# EAGLE design H0FR1 (EAGLE 9.6.1)

## Sheet 1 of 2
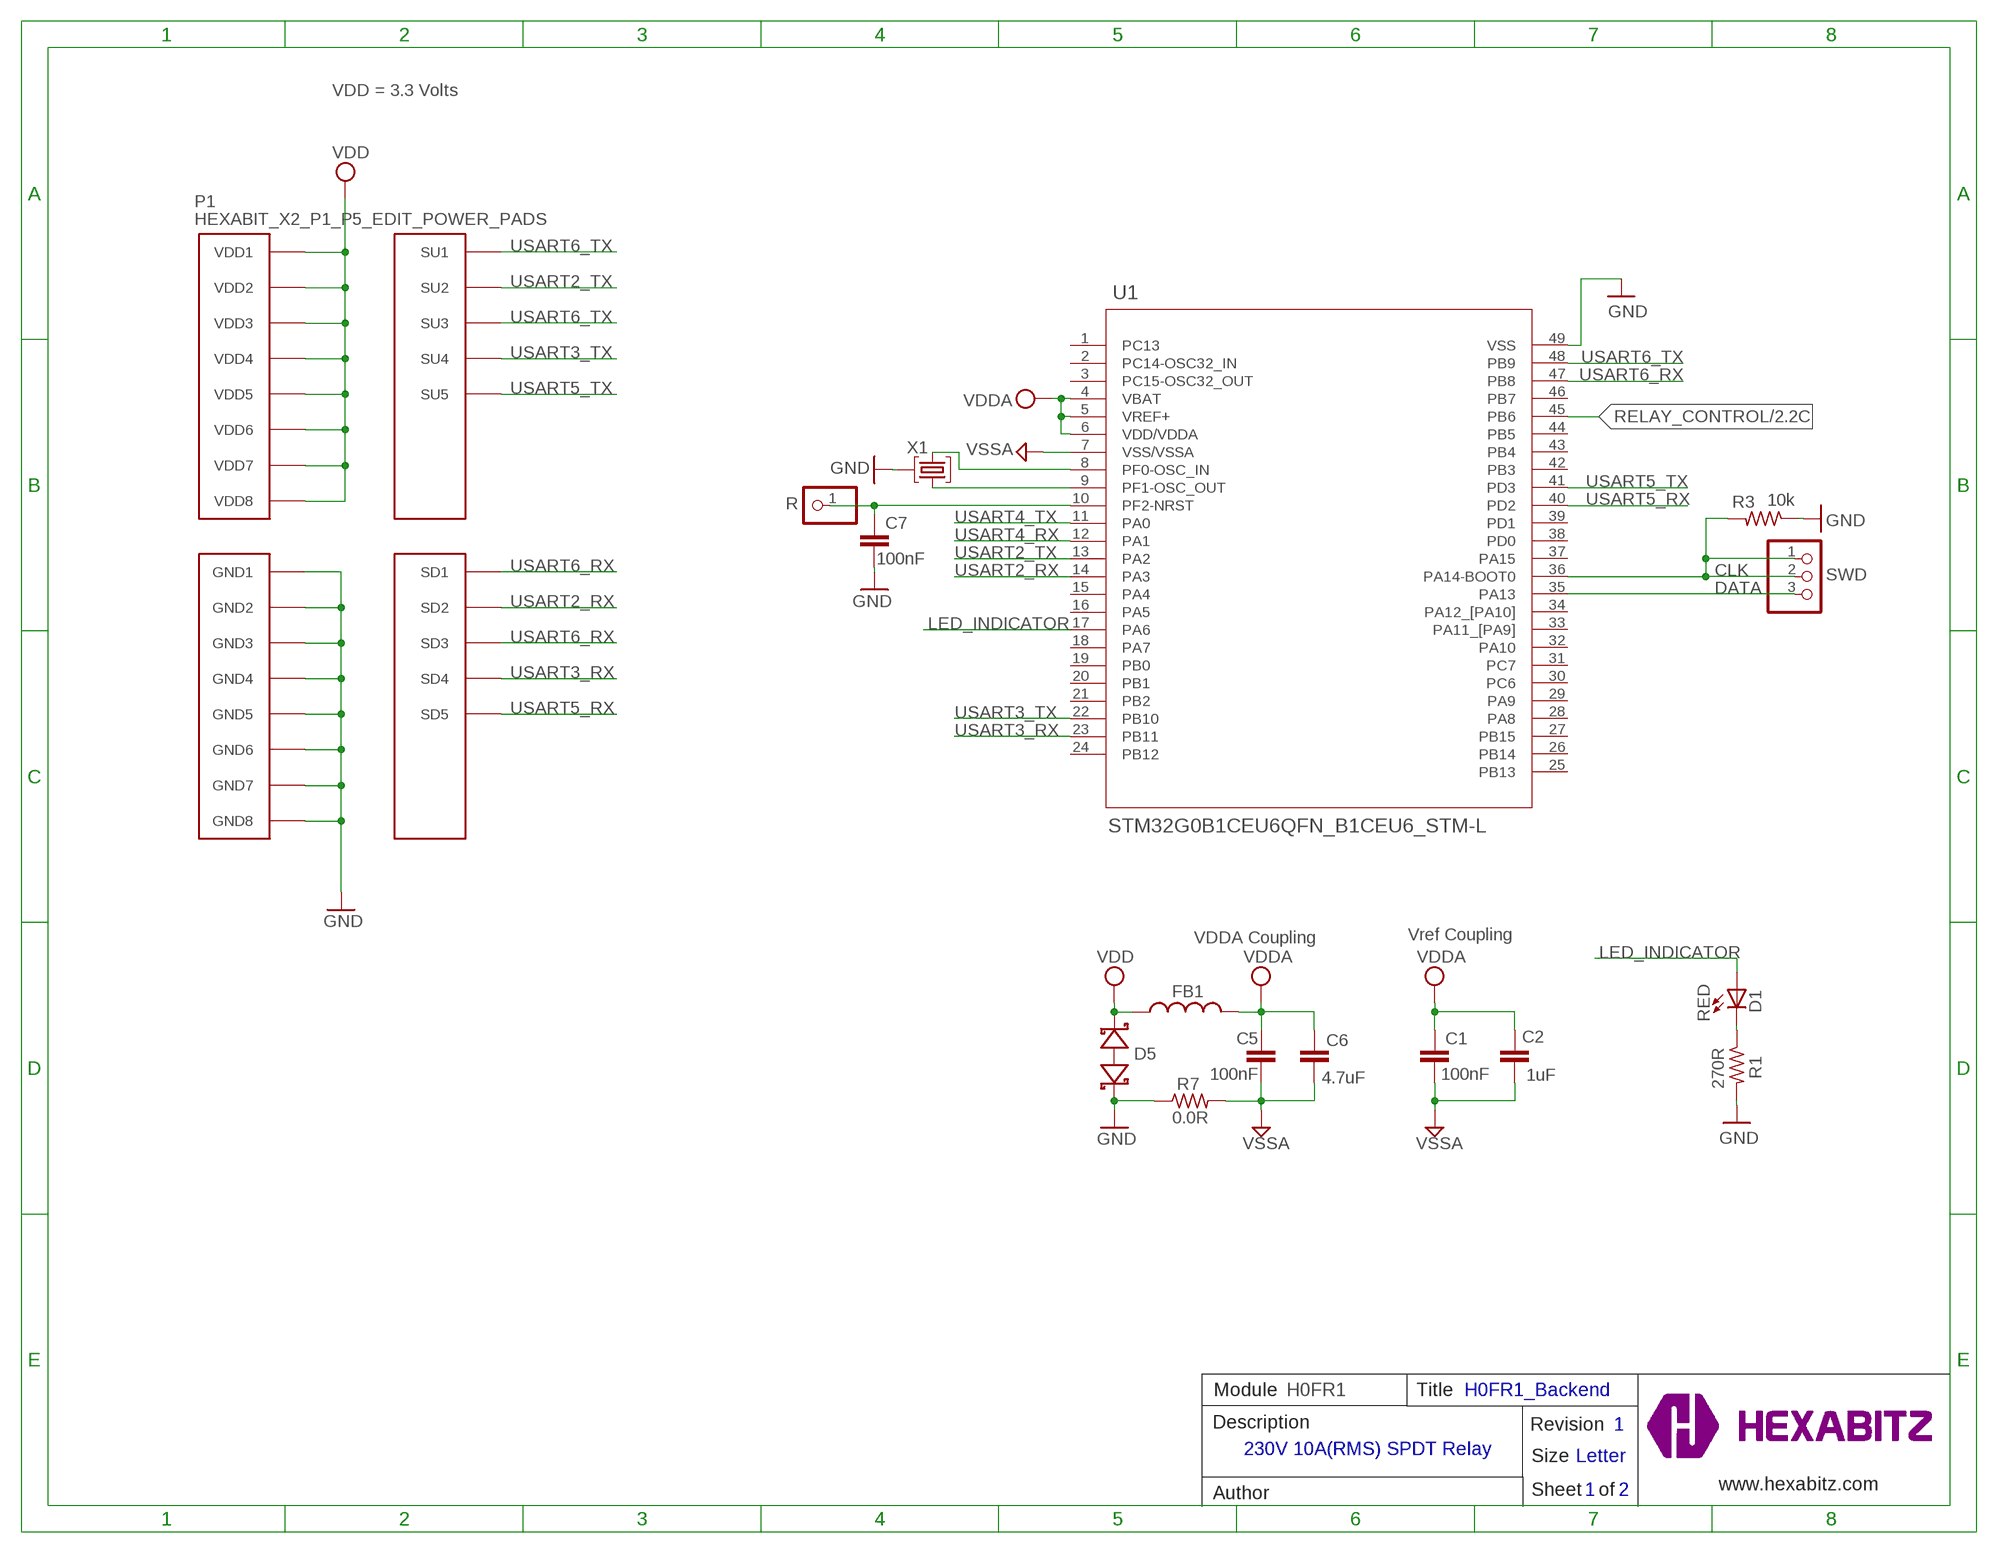
[diagram p0: schematic, sheet 1]

### Parts
C1  100nF  C-0603  [C-0603]
C2  1uF  C-0805  [C-0805]
C5  100nF  C-0603  [C-0603]
C6  4.7uF  C-0805  [C-0805]
C7  100nF  C-0603  [C-0603]
D1  RED  VLMS1300-GS08  [VLMS1300-GS08]
D5  BOURNS_CDSOD323-T03SCBOURNS_CDSOD323-T03SC_0_0  [BOURNS_CDSOD323-T03SC_0]
FB1  FB-0603  [FB-0603]
P1  HEXABIT_X2_P1_P5_EDIT_POWER_PADS  [HEXABIT_X2_P1_P5_EDIT_POWER_PADS]
R  R  PINHD-1X1  [1X01]
R1  270R  R-0603  [R-0603]
R3  10k  R-0603  [R-0603]
R7  0.0R  R-0603  [R-0603]
SWD  PINHD-1X3SWD  [SWD]
TRIMBLE-LOGO2  HEXA-LOGO  [HEXA-LOGO]
U1  STM32G0B1CEU6QFN_B1CEU6_STM-L  [QFN_B1CEU6_STM-L]
X1  XTALL_CSTCE8M00G52  [XTALL_CSTCE8M00G52]

### Nets
CLK: R3.2 SWD.1 SWD.2 U1.36(PA14-BOOT0)
DATA: SWD.3 U1.35(PA13)
GND: C7.2 D5.2(C) P1.PAD_PD11(GND1) P1.PAD_PD12(GND2) P1.PAD_PD13(GND3) P1.PAD_PD14(GND4) P1.PAD_PD17(GND5) P1.PAD_PD18(GND6) P1.PAD_PD19(GND7) P1.PAD_PD20(GND8) R1.2 R3.1 R7.1 U1.49(VSS) X1.P$2 ; also sheet 2
LED_INDICATOR: D1.A U1.17(PA6)
N$2: D1.C R1.1
N$4: C7.1 R.1 U1.10(PF2-NRST)
N$5: U1.9(PF1-OSC_OUT) X1.P$1
N$6: U1.8(PF0-OSC_IN) X1.P$3
RELAY_CONTROL: U1.45(PB6) ; also sheet 2
USART2_RX: P1.PAD_PD2(SD2) U1.14(PA3)
USART2_TX: P1.PAD_PU2(SU2) U1.13(PA2)
USART3_RX: P1.PAD_PD4(SD4) U1.23(PB11)
USART3_TX: P1.PAD_PU4(SU4) U1.22(PB10)
USART4_RX: U1.12(PA1)
USART4_TX: U1.11(PA0)
USART5_RX: P1.PAD_PD5(SD5) U1.40(PD2)
USART5_TX: P1.PAD_PU5(SU5) U1.41(PD3)
USART6_RX: P1.PAD_PD1(SD1) P1.PAD_PD3(SD3) U1.47(PB8)
USART6_TX: P1.PAD_PU1(SU1) P1.PAD_PU3(SU3) U1.48(PB9)
VDD: D5.1(A) FB1.1 P1.PAD_PU11(VDD1) P1.PAD_PU12(VDD2) P1.PAD_PU13(VDD3) P1.PAD_PU14(VDD4) P1.PAD_PU17(VDD5) P1.PAD_PU18(VDD6) P1.PAD_PU19(VDD7) P1.PAD_PU20(VDD8) ; also sheet 2
VDDA: C1.1 C2.1 C5.1 C6.1 FB1.2 U1.4(VBAT) U1.5(VREF+) U1.6(VDD/VDDA)
VSSA: C1.2 C2.2 C5.2 C6.2 R7.2 U1.7(VSS/VSSA)
Unconnected: U1.1(PC13) U1.2(PC14-OSC32_IN) U1.3(PC15-OSC32_OUT) U1.15(PA4) U1.16(PA5) U1.18(PA7) U1.19(PB0) U1.20(PB1) U1.21(PB2) U1.24(PB12) U1.25(PB13) U1.26(PB14) U1.27(PB15) U1.28(PA8) U1.29(PA9) U1.30(PC6) U1.31(PC7) U1.32(PA10) U1.33(PA11_[PA9]) U1.34(PA12_[PA10]) U1.37(PA15) U1.38(PD0) U1.39(PD1) U1.42(PB3) U1.43(PB4) U1.44(PB5) U1.46(PB7)

### Notes on the sheet
- VDD = 3.3 Volts
- BOOT
- VDDA Coupling | Vref Coupling
- Module | H0FR1 | Title | H0FR1_Backend
- Description | Revision | 1
- 230V 10A(RMS) SPDT Relay
- Size | Letter
- www.hexabitz.com
- Author | Sheet   of | 1 | 2
- C:/Users/Admin/Desktop/logodraft.bmp

## Sheet 2 of 2
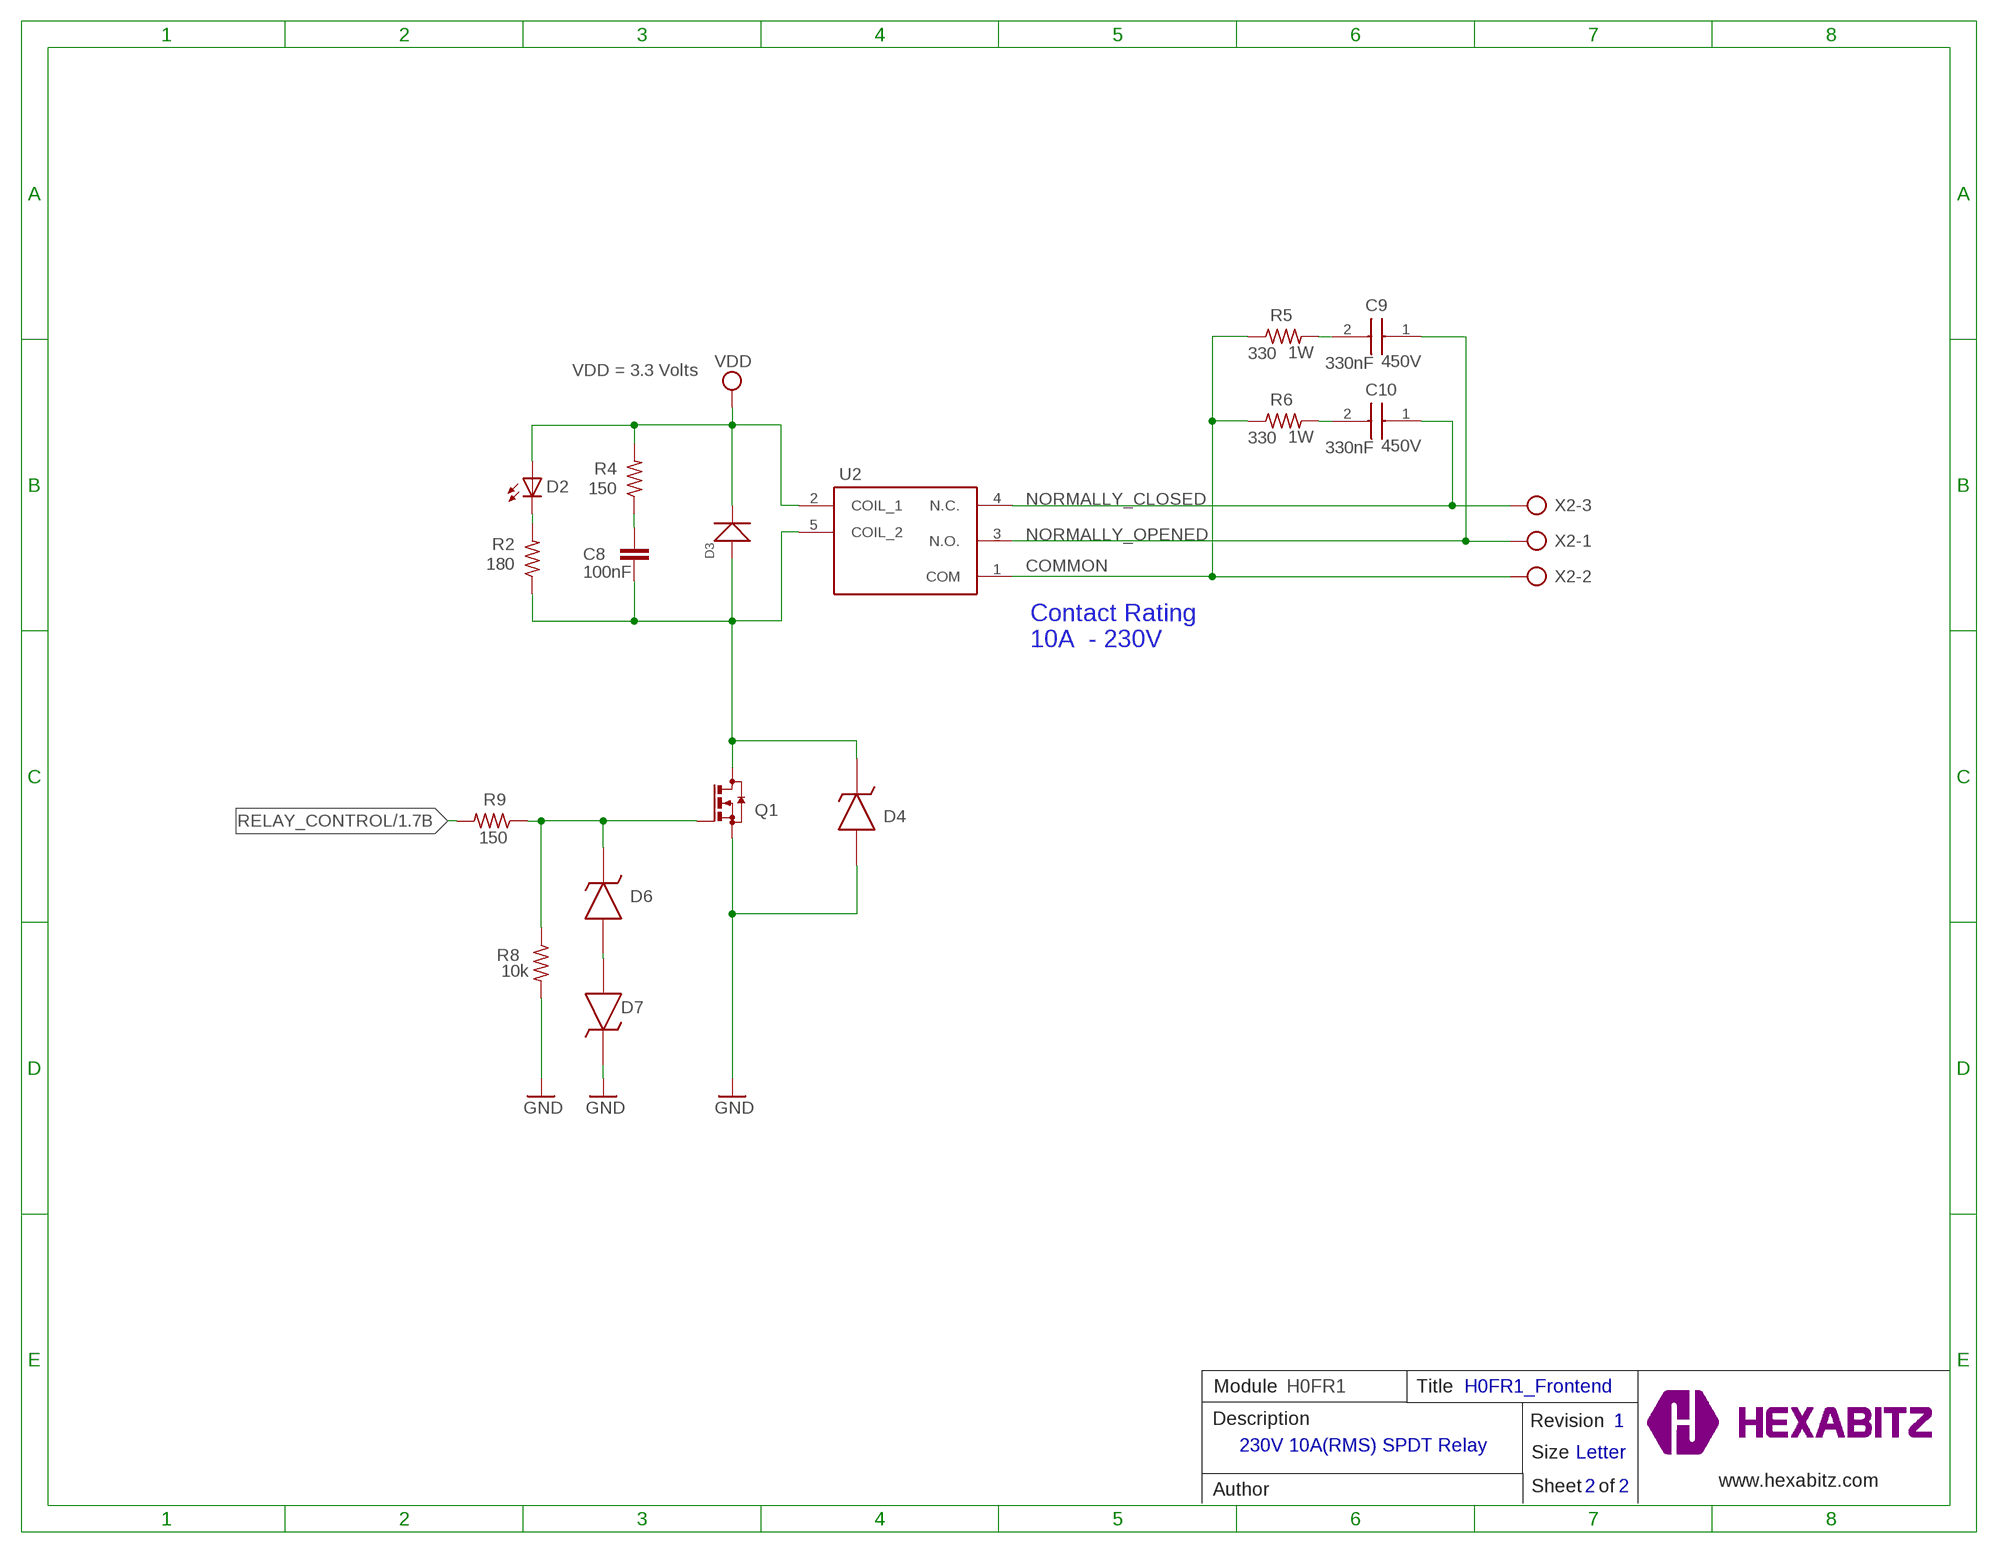
[diagram p1: schematic, sheet 2]

### Parts
C8  100nF  C-0603  [C-0603]
C9  330nF  B32922Q3334K000  [B32922Q_(18_X_8.5)]
C10  330nF  B32922Q3334K000  [B32922Q_(18_X_8.5)]
D2  RED  VLMS1300-GS08  [VLMS1300-GS08]
D3  40V 300MA  BAT54JFILM_SOD-323  [SOD-323]
D4  MMSZ4705T1GMMSZ4705T1G  [DIO_MMSZ4700T1G]
D6  MMSZ4705T1GMMSZ4705T1G  [DIO_MMSZ4700T1G]
D7  MMSZ4705T1GMMSZ4705T1G  [DIO_MMSZ4700T1G]
Q1  BSS123  [SOT23]
R2  180  R-0603  [R-0603]
R4  150  R-0603  [R-0603]
R5  330  R-US_R2512  [R2512]
R6  330  R-US_R2512  [R2512]
R8  10k  R-0603  [R-0603]
R9  150  R-0603  [R-0603]
U2  G5LE-14_DC3  [G5LE-14_SPDT]
X2  AK300/3  [AK300/3]

### Nets
COMMON: R5.1 R6.1 U2.1(COM) X2.2
GND: D4.A D7.K Q1.2(S) R8.2 ; also sheet 1
N$1: D6.A D7.A
N$3: D6.K Q1.1(G) R8.1 R9.1
N$8: D2.C R2.2
N$9: C9.2 R5.2
N$11: C8.1 R4.1
N$12: C10.2 R6.2
N$15: C8.2 D3.+ D4.K Q1.3(D) R2.1 U2.5(COIL_2)
NORMALLY_CLOSED: C10.1 U2.4(N.C.) X2.3
NORMALLY_OPENED: C9.1 U2.3(N.O.) X2.1
RELAY_CONTROL: R9.2 ; also sheet 1
VDD: D2.A D3.- R4.2 U2.2(COIL_1) ; also sheet 1

### Notes on the sheet
- VDD = 3.3 Volts
- Contact Rating
  10A  - 230V
- Module | H0FR1 | Title | H0FR1_Frontend
- Description | Revision | 1
- 230V 10A(RMS) SPDT Relay
- Size | Letter
- www.hexabitz.com
- Author | Sheet   of | 2 | 2

## Library data of the parts
C1 C8 = HEXABITZ_RCLS:C-0603: CAP CER 10% X7R 0603; CAPACITANCE: 100nF; MFN: KEMET; MPN: C0603C104K8RACTU; OCTOPART_URL: https://octopart.com/c0603c104k8ractu-kemet-145075?r=sp&s=9bS9ASSwSEqMCE9KBEQZ0g; TOLERANCE: 10%; VOLTAGE_RATING: 10V
C2 = HEXABITZ_RCLS:C-0805: CAP CER 10% X7R 0805; CAPACITANCE: 1.00uF; MFN: Yageo; MPN: CC0805KKX7R7BB105; OCTOPART_URL: https://octopart.com/cc0805kkx7r7bb105-yageo-8376555?r=sp&s=YKl1wwtkROau_X5nniH2ig; TOLERANCE: 10%; VOLTAGE_RATING: 16V
C5 C7 = HEXABITZ_RCLS:C-0603: CAP CER 10% X7R 0603
C6 = HEXABITZ_RCLS:C-0805: CAP CER 10% X7R 0805; CAPACITANCE: 4.7uF; MFN: Murata; MPN: GRM21BC81E475KA12L; OCTOPART_URL: https://octopart.com/grm21bc81e475ka12l-murata-10331911?r=sp&s=RY3qZSD8T6mG6TC9CHI5qQ; TOLERANCE: 10%; VOLTAGE_RATING: 25V
C9 C10 = HEXABITZ_RCLS:B32922Q3334K000: EMI Suppression Capacitors Source: Datasheet <https://product.tdk.com/system/files/dam/doc/product/capacitor/film/emi/data_sheet/x2_b32922_924_p_q.pdf>; DESCRIPTION: EMI Suppression Capacitors; HEIGHT: 14.5mm; MANUFACTURER_NAME: TDK; MANUFACTURER_PART_NUMBER: B32922Q3334K000; MOUSER_PART_NUMBER: 871-B32922Q3334K000; MOUSER_PRICE-STOCK: https://www.mouser.co.uk/ProductDetail/EPCOS-TDK/B32922Q3334K000?qs=KUoIvG%2F9IlZpggMZ8F%2FNNQ%3D%3D; VOLTAAGE: 450V
D1 = HEXABITZ_USER_INTERFACE_PARTS:VLMS1300-GS08: Red 0603 130° Clear 54 mcd 2 V Surface Mount ChipLED ; Octopart Url : http://octopart.com/vlms1300-gs08-vishay-21709201; MFN: Vishay; MPN: VLMS1300-GS08; OCTOPART_URL: https://octopart.com/vlms1300-gs08-vishay-21709201?r=sp&s=_gcP4_q8T1SC6PJQPTQ9yA
D2 = Hexabitz:VLMS1300-GS08: Red 0603 130° Clear 54 mcd 2 V Surface Mount ChipLED ; Octopart Url : http://octopart.com/vlms1300-gs08-vishay-21709201; MFN: Vishay; MPN: VLMY1300-GS08; OCTOPART_URL: https://octopart.com/vlmy1300-gs08-vishay-21709204
D3 = HEXABITZ_RCLS:BAT54JFILM_SOD-323: 304020019; MPN: BAT54JFILM
D4 D6 D7 = HEXABITZ_RCLS:MMSZ4705T1G: 18 V Low Current ZenerDiodeVoltage Regulator Source: Datasheet <http://www.onsemi.com/pub/Collateral/MMSZ4678T1-D.PDF>
D5 = HEXABITZ_RCLS:BOURNS_CDSOD323-T03SC: CDSOD323-TxxSC - TVS Diode Series; DESCRIPTION: Dio Tvs Vwm 03V 500W Bidir Sod323 / Tape & Reel - 7" Reel; MFN: Bourns; MPN: CDSOD323-T03SC; OCTOPART_URL: https://octopart.com/cdsod323-t03sc-bourns-10487153?r=sp
FB1 = HEXABITZ_RCLS:FB-0603: Ferrite Beads Multi-Layer 0603
P1 = hexabitz_connectors:HEXABIT_X2_P1_P5_EDIT_POWER_PADS
Q1 = HEXABITZ_RCLS:BSS123: N-CHANNEL MOS FET; DESCRIPTION: Transistor MOSFET Negative Channel 100 Volt 0.17A 3-Pin SOT-23; MFN: ON Semiconductor; MPN: BSS123; OCTOPART_URL: https://octopart.com/bss123-on+semiconductor-20837328?r=sp
R = HEXABITZ_USER_INTERFACE_PARTS:PINHD-1X1: PIN HEADER; MFN: TE Connectivity; MPN: 87227-1; OCTOPART_URL: https://octopart.com/87227-1-te+connectivity-39512052?r=sp
R1 R7 = HEXABITZ_RCLS:R-0603: Thick Film Resistors - SMD 0603
R2 = HEXABITZ_RCLS:R-0603: Thick Film Resistors - SMD 0603; MFN: Panasonic; MPN: ERJ-3GEYJ181V; OCTOPART_URL: https://octopart.com/erj-3geyj181v-panasonic-55403673; RESISTANCE: 180.0 Ω; TOLERANCE: ±5%
R3 = HEXABITZ_RCLS:R-0603: Thick Film Resistors - SMD 0603; MFN: Yageo; MPN: RC0603JR-0710KL; OCTOPART_URL: https://octopart.com/search?q=RC0603JR-0710KL&start=0; RESISTANCE: 10.0K Ohm; TOLERANCE: 5%
R4 R8 R9 = HEXABITZ_RCLS:R-0603: Thick Film Resistors - SMD 0603; MFN: Yageo; MPN: RC0603JR-07680KL; OCTOPART_URL: https://octopart.com/rc0603jr-07680kl-yageo-40953169?r=sp; RESISTANCE: 680K Ohm; TOLERANCE: 5%
R5 R6 = HEXABITZ_RCLS:R-US_: RESISTOR, American symbol; MPN: RMCF2512JT330R; POWER: 1W; SPICEPREFIX: R
SWD = HEXABITZ_CONNECTION_PARTS:PINHD-1X3: PIN HEADER
TRIMBLE-LOGO2 = HEXABITZ_USER_INTERFACE_PARTS:HEXA-LOGO: Trimble-Logo
U1 = HEXABITZ_ICs:STM32G0B1CEU6; COPYRIGHT: Copyright (C) 2021 Ultra Librarian. All rights reserved.; MANUFACTURER_PART_NUMBER: STM32G0B1CEU6; MFR_NAME: STMicroelectronics
U2 = HEXABITZ_OTHER_PARTS:G5LE-14_DC: General Purpose Relays Power PCB Relay Source: Datasheet <https://omronfs.omron.com/en_US/ecb/products/pdf/en-g5le.pdf>; DESCRIPTION: General Purpose Relays Power PCB Relay; HEIGHT: mm; MANUFACTURER_NAME: Omron Electronics; MANUFACTURER_PART_NUMBER: G5LE-14 DC3; MOUSER_PART_NUMBER: 653-G5LE-14DC3; MOUSER_PRICE-STOCK: https://www.mouser.com/Search/Refine.aspx?Keyword=653-G5LE-14DC3
X1 = HEXABITZ_RCLS:XTALL_CSTCE8M00G52: MURATA CSTCE8M00G52-R0 RESONATOR, SMD, 8MHZ ; Octopart Url : https://octopart.com/cstce8m00g52-r0-murata-7145559; MFN: Murata; MPN: CSTCE8M00G52Z-R0; OCTOPART_URL: https://octopart.com/cstce8m00g52z-r0-murata-17755941?r=sp&s=JDnNJnrHQhyS8Zk4ofFWXw
X2 = HEXABITZ_CONNECTION_PARTS:AK300/3: CONNECTOR; OC_FARNELL: unknown; OC_NEWARK: unknown

## Board
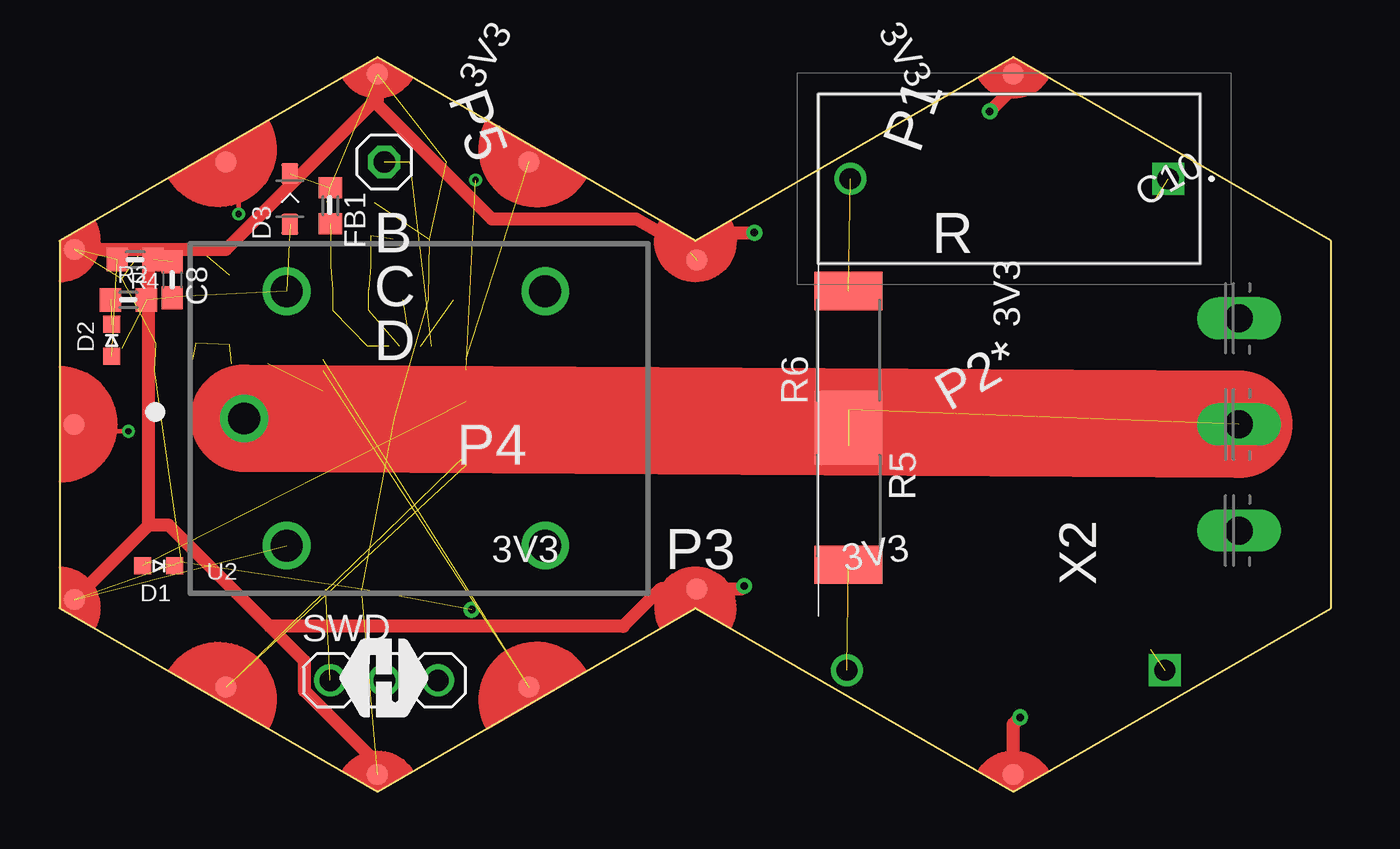
[diagram p2: board, top side]
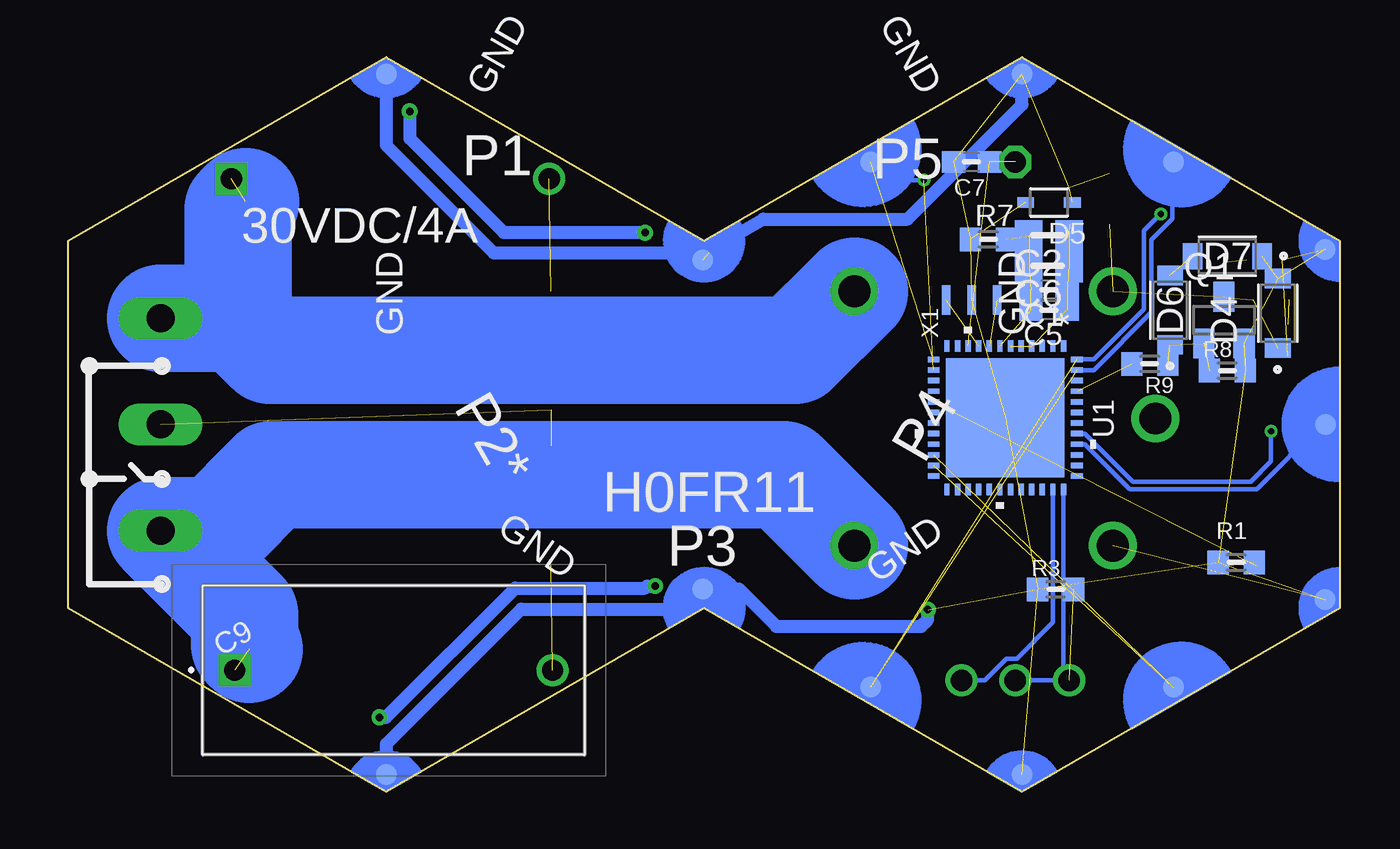
[diagram p3: board, bottom side, seen from below]

Size 60 x 34.64 mm. Coordinates in mm from the lower left corner, seen from the top.
Copper layers (1*16): Top 0.035mm / dielectric 1.5mm / Bottom 0.035mm
Design rules "2_layer *": minimum track width 6mil, minimum drill 0.25mm, track to track 6mil, track to pad 6mil, pad to pad 6mil, via to via 6mil, smd to smd 0mil, copper to edge 0.15mm, drill to drill 8mil, minimum pad ring 10mil, minimum via ring 6mil, stop-mask expansion 2mil, vias tented up to drill 15mil, thermal gap 10mil

### Footprints (pad centres in the part's own frame; a part is rotated, then mirrored left to right if it is on the bottom)
C-0603 = smd 1.1 x 1: 1 -0.85,0; 2 0.85,0
C-0805 = smd 1.3 x 1.5: 1 -0.95,0; 2 0.95,0
B32922Q_(18_X_8.5) = drill 1 pad 1.5 square: 1 0,0 | drill 1 pad 1.5: 2 15,0
VLMS1300-GS08 = smd 0.8 x 0.8: A 0,0.75; C 0,-0.75
SOD-323 = smd 1 x 0.8: + -1.2,0; - 1.2,0
DIO_MMSZ4700T1G = smd 0.915 x 1.22: A 1.637,0; K -1.637,0
BOURNS_CDSOD323-T03SC_0 = smd 0.8 x 0.5: 1 -1.1,0; 2 1.1,0
FB-0603 = smd 1 x 1.1: 1 -0.85,0; 2 0.85,0
HEXABIT_X2_P1_P5_EDIT_POWER_PADS = smd 1 x 1 bottom: PAD_PD1 12.39,22.39; PAD_PD2 12.39,8.09; PAD_PD3 -12.39,8.09; PAD_PD4 -12.39,22.39; PAD_PD5 0,29.55; PAD_PD12 16.52,15.24; PAD_PD13 7.752,0.168; PAD_PD14 16.52,-14.76; PAD_PD17 -16.52,-14.76; PAD_PD18 -7.752,0.168; PAD_PD19 -16.52,15.24 | smd 1 x 1 rotated 60 bottom: PAD_PD11 8.26,29.547 | smd 1 x 1 rotated 120 bottom: PAD_PD20 -8.26,29.547 | smd 1 x 1: PAD_PU1 12.39,22.39; PAD_PU2 12.39,8.09; PAD_PU3 -12.39,8.09; PAD_PU4 -12.39,22.39; PAD_PU5 0,29.55; PAD_PU12 16.52,15.24; PAD_PU13 7.752,0.168; PAD_PU14 16.52,-14.76; PAD_PU17 -16.52,-14.76; PAD_PU18 -7.752,0.168; PAD_PU19 -16.52,15.24 | smd 1 x 1 rotated 60: PAD_PU11 8.26,29.547 | smd 1 x 1 rotated 120: PAD_PU20 -8.26,29.547
SOT23 = smd 1 x 1.4: 1 -0.95,-1.1; 2 0.95,-1.1; 3 0,1.1
1X01 = drill 1.016 octagon: 1 0,0
R-0603 = smd 1 x 1.1: 1 -0.85,0; 2 0.85,0
R2512 = smd 1.8 x 3.2: 1 -2.8,0; 2 2.8,0
SWD = drill 1.016: 1 -2.54,0; 2 0,0; 3 2.54,0
QFN_B1CEU6_STM-L = smd 0.55 x 0.254: 1 -3.38,2.751; 2 -3.38,2.251; 3 -3.38,1.75; 4 -3.38,1.25; 5 -3.38,0.75; 6 -3.38,0.25; 7 -3.38,-0.25; 8 -3.38,-0.75; 9 -3.38,-1.25; 10 -3.38,-1.75; 11 -3.38,-2.251; 12 -3.38,-2.751; 25 3.38,-2.751; 26 3.38,-2.251; 27 3.38,-1.75; 28 3.38,-1.25; 29 3.38,-0.75; 30 3.38,-0.25; 31 3.38,0.25; 32 3.38,0.75; 33 3.38,1.25; 34 3.38,1.75; 35 3.38,2.251; 36 3.38,2.751 | smd 0.254 x 0.55: 13 -2.751,-3.38; 14 -2.251,-3.38; 15 -1.75,-3.38; 16 -1.25,-3.38; 17 -0.75,-3.38; 18 -0.25,-3.38; 19 0.25,-3.38; 20 0.75,-3.38; 21 1.25,-3.38; 22 1.75,-3.38; 23 2.251,-3.38; 24 2.751,-3.38; 37 2.751,3.38; 38 2.251,3.38; 39 1.75,3.38; 40 1.25,3.38; 41 0.75,3.38; 42 0.25,3.38; 43 -0.25,3.38; 44 -0.75,3.38; 45 -1.25,3.38; 46 -1.75,3.38; 47 -2.251,3.38; 48 -2.751,3.38 | smd 5.6 x 5.6: 49 0,0
G5LE-14_SPDT = drill 1.5 pad 2.25: 1 -2,6; 2 0,0; 3 12.2,0; 4 12.2,12; 5 0,12
XTALL_CSTCE8M00G52 = smd 1.4 x 0.4: P$1 0,1.2; P$2 0,0; P$3 0,-1.2
AK300/3 = drill 1.321 long: 1 -5.004,0; 2 0,0; 3 5.004,0

### Placement (x,y rotation side)
C1  13.73,23.67 180 bottom
C2  13.73,26.21 180 bottom
C5  13.73,22.72 180 bottom
C6  13.73,24.78 180 bottom
C7  17.38,29.7 180 bottom
C8  5.32,24.15 270 top
C9  52.15,5.73 0 bottom
C10  52.31,28.91 180 top
D1  4.68,10.65 90 top
D2  2.46,21.29 180 top
D3  10.87,27.96 90 top
D4  2.93,22.56 90 bottom
D5  13.73,27.8 180 bottom
D6  8.01,22.72 90 bottom
D7  5.32,25.26 180 bottom
FB1  12.78,27.64 270 top
P1  30.24,17.32 90 top
Q1  5.47,22.24 0 bottom
R  15.32,29.7 90 top
R1  4.9,10.81 180 bottom
R2  3.25,23.19 180 top
R3  13.41,9.54 0 bottom
R4  3.57,25.1 180 top
R5  37.22,13.51 270 top
R6  37.22,20.81 90 top
R7  16.59,26.05 0 bottom
R8  5.32,19.86 0 bottom
R9  8.97,20.18 180 bottom
SWD  15.32,5.26 0 top
TRIMBLE-LOGO2  15.32,3.51 0 top
U1  15.79,17.64 270 bottom
U2  10.71,11.61 0 top
X1  17.38,23.19 90 bottom
X2  55.64,17.32 90 top

### Tracks (layer width: path | path; a pad name or v marks a point on that pad's centre or on a via)
CLK  (1 unrouted)
  Bottom 0.203: SWD.1 12.94,5.41 | 12.94,5.41 13.04,5.52 U1.36 | SWD.2 13.1,5.25 12.94,5.41
COMMON  (2 unrouted)
  Top 5.08: U2.1 X2.2
DATA
  Bottom 0.203: U1.35 13.54,7.98 15.25,6.27 15.74,6.27 16.75,5.25 SWD.3
GND  (via drill 0.35 pad 0.75)  (16 unrouted)
  Bottom 0.61: P1.PAD_PD14 45,30.49 39.92,25.42 29.76,25.42 | P1.PAD_PD17 45,2.24 38.63,8.62 31.02,8.62 P1.PAD_PD18 28.36,9.57 26.59,7.79 19.76,7.79 19.45,8.11 v19.45,8.59 | P1.PAD_PD13 29.4,25.74 27.22,27 20.4,27 15,32.4 P1.PAD_PD12
LED_INDICATOR  (1 unrouted)
N$1  (1 unrouted)
N$2  (1 unrouted)
N$3  (3 unrouted)
N$4  (2 unrouted)
N$5  (1 unrouted)
N$6  (1 unrouted)
N$8  (1 unrouted)
N$9  (1 unrouted)
N$11  (1 unrouted)
N$12  (1 unrouted)
N$15  (5 unrouted)
NORMALLY_CLOSED  (1 unrouted)
  Bottom 5.08: X2.3 51.99,22.32 | 51.99,22.32 50.48,20.81 25.71,20.81 U2.4 | 51.99,22.32 51.99,27.46 51.63,27.82
NORMALLY_OPENED  (1 unrouted)
  Bottom 5.08: U2.3 26.25,14.94 50.4,14.94 53.02,12.32 X2.1 51.67,8.35 51.67,6.93 51.47,6.72
RELAY_CONTROL  (1 unrouted)
USART2_RX  (via drill 0.3 pad 0.6)  (1 unrouted)
  Bottom 0.203: P1.PAD_PD2 21.29,28.85 v19.63,28.85
USART2_TX  (1 unrouted)
USART3_RX  (1 unrouted)
USART3_TX  (1 unrouted)
USART5_RX
  Bottom 0.203: P1.PAD_PD5 0.88,17.32 3.93,14.27 9.91,14.27 12.03,16.39 U1.40
USART5_TX  (via drill 0.3 pad 0.6)
  Top 0.203: v3.25,17 1.01,17 P1.PAD_PU5
  Bottom 0.203: U1.41 12.03,16.89 9.76,14.62 4.21,14.62 3.25,15.57 v3.25,17
USART6_RX  (1 unrouted)
  Bottom 0.203: U1.47 11.61,19.89 8.89,22.61 8.89,26.02 7.9,27.02 7.9,29.66 P1.PAD_PD1
USART6_TX  (via drill 0.3 pad 0.6)  (1 unrouted)
  Top 0.203: v8.45,27.25 8.45,29.11 P1.PAD_PU1
  Bottom 0.203: U1.48 11.61,20.39 9.25,22.75 9.25,26.45 v8.45,27.25
VDD  (via drill 0.35 pad 0.75)  (6 unrouted)
  Top 0.61: v32.78,26.37 31.68,26.37 30.94,25.94 P1.PAD_PU13 29.4,25.74 27.22,27 20.4,27 15,32.4 15,32.72 | P1.PAD_PU14 45,33.19 v43.89,32.08 | 15,32.72 P1.PAD_PU12 | P1.PAD_PU11 4.21,25.58 | 4.21,25.58 7.86,25.58 15,32.72 | P1.PAD_PU20 4.21,12.57 | 4.21,12.57 4.21,25.58 | P1.PAD_PU19 15,1.31 11.56,4.75 11.56,6.16 9.92,7.79 | 4.21,12.57 5.14,12.57 9.92,7.79 | 9.92,7.79 26.59,7.79 28.36,9.57 P1.PAD_PU18 32.17,9.57 v32.3,9.7 | P1.PAD_PU17 45,3.19 v45.32,3.51
  Bottom 0.61: v32.78,26.37 39.45,26.37 43.89,30.81 v43.89,32.08 | v45.32,3.51 45,3.51 38.91,9.61 32.78,9.61 32.69,9.7 v32.3,9.7
  cutout Top (no thermals): 26.75,23.35 arc90 23.89,26.21 20.24,26.21 arc90 19.76,25.73 19.76,21.29 arc90 20.71,20.34 26.59,20.34 arc90 26.75,20.5
  cutout Top (no thermals): 26.75,11.92 arc90 23.89,14.78 20.24,14.78 arc90 19.76,14.3 19.76,9.86 arc90 20.71,8.91 26.59,8.91 arc90 26.75,9.07
  cutout Bottom (no thermals): 4.84,17.64 arc-90 7.7,20.5 11.35,20.5 arc-90 11.82,20.02 11.82,15.57 arc-90 10.87,14.62 5,14.62 arc-90 4.84,14.78
VDDA  (7 unrouted)
VSSA  (5 unrouted)

### Text on the board
tPlace: 3V3 | 3V3 | P5 | P1 | R | B | 3V3 | C | D | P2* | P4 | 3V3 | P3 | 3V3
bPlace: GND | GND | P5 | P1 | 30VDC/4A | GND | GND | P4 | P2* | H0FR11 | GND | P3 | GND
tDocu: Note: This module should be / manufactured with 1oz copper / to handle 4A current.